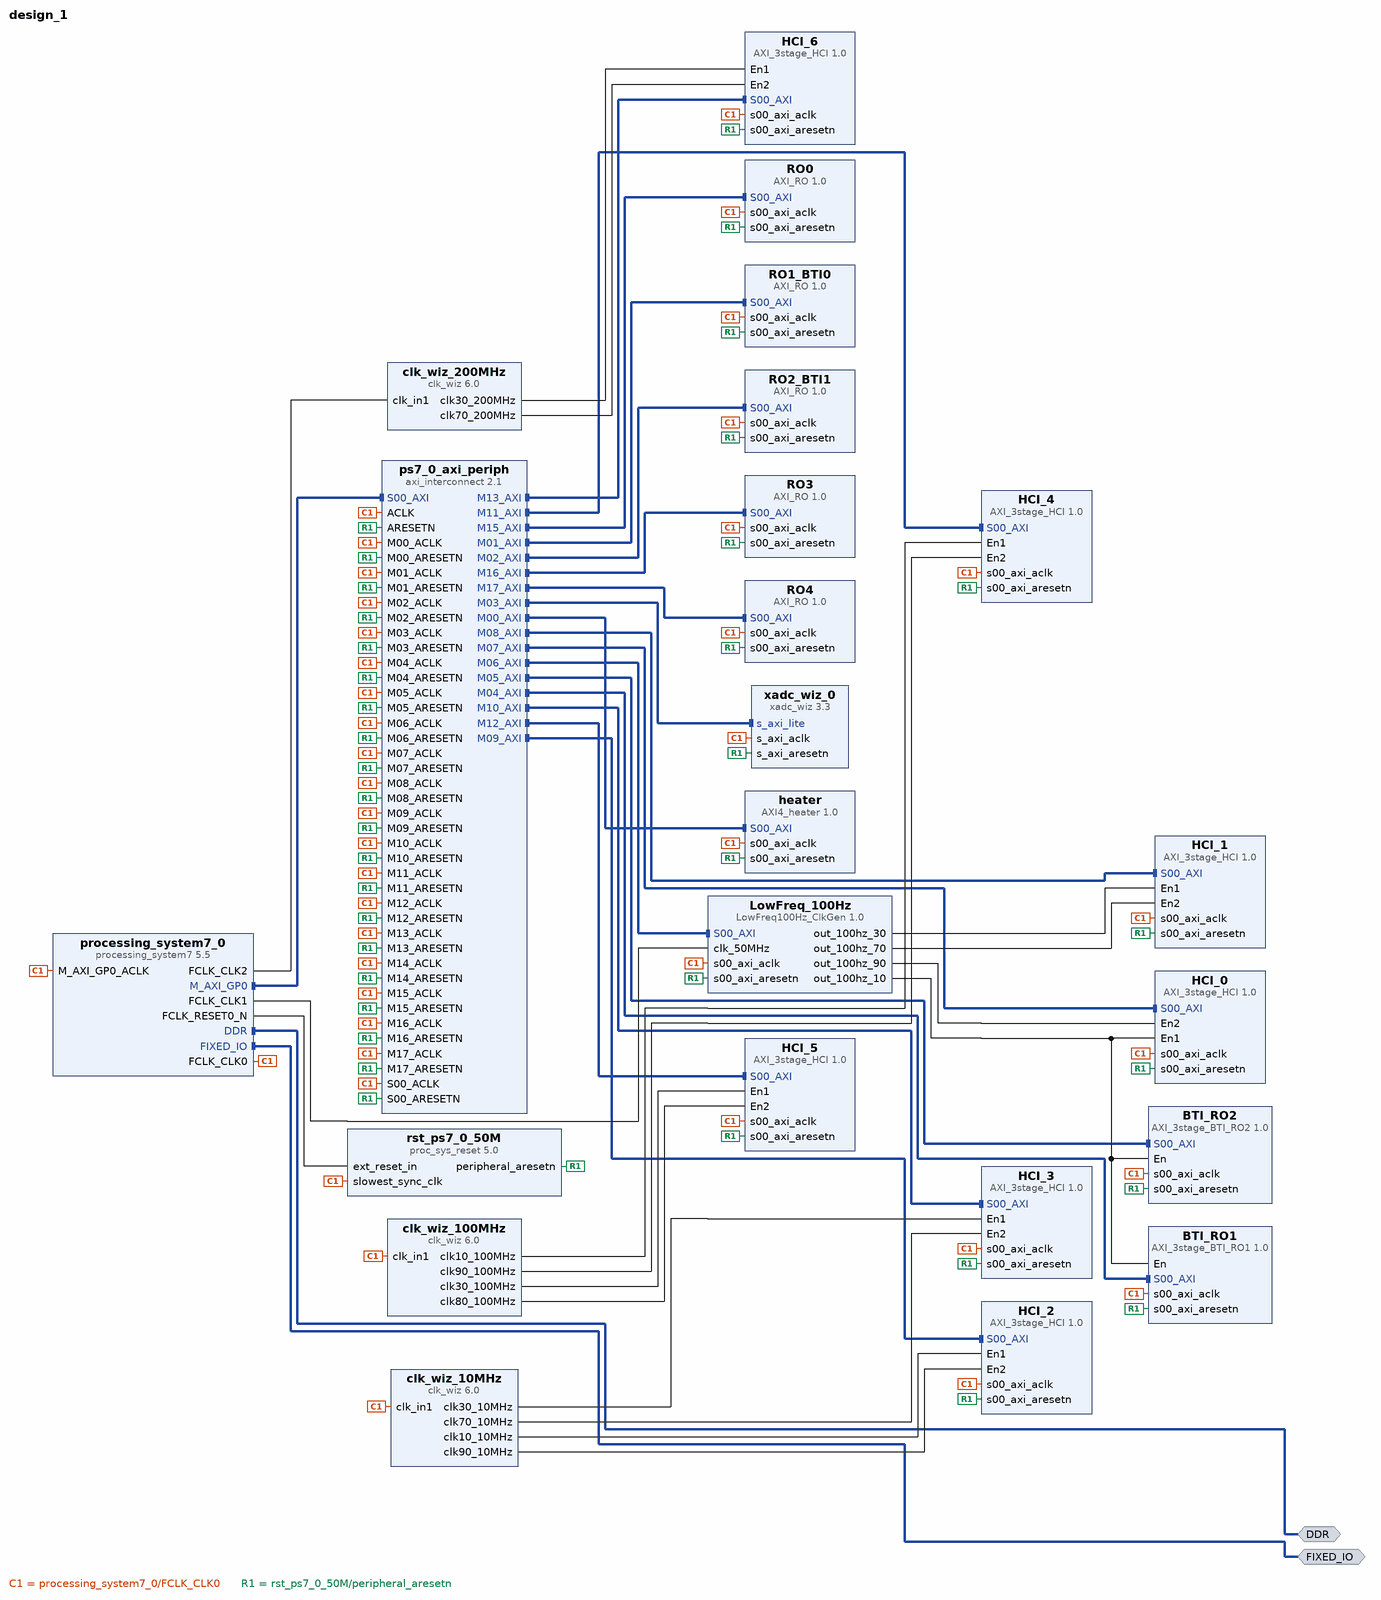
[diagram p0: block diagram of the top level]
# Vivado block design design_1, xc7z020clg400-1, Vivado 2020.1
create_bd_design design_1

create_bd_intf_port -mode Master -vlnv xilinx.com:interface:ddrx_rtl:1.0 DDR
create_bd_intf_port -mode Master -vlnv xilinx.com:display_processing_system7:fixedio_rtl:1.0 FIXED_IO

create_bd_cell -type ip -vlnv xilinx.com:user:AXI4_heater:1.0 heater
set_property -dict {CONFIG.block_size 36 CONFIG.num_blocks 64} [get_bd_cells heater]
create_bd_cell -type ip -vlnv xilinx.com:ip:xadc_wiz:3.3 xadc_wiz_0
set_property -dict [list \
  CONFIG.ENABLE_VCCDDRO_ALARM false \
  CONFIG.ENABLE_VCCPAUX_ALARM false \
  CONFIG.ENABLE_VCCPINT_ALARM false \
  CONFIG.OT_ALARM false \
  CONFIG.TEMPERATURE_ALARM_OT_RESET 125.0 \
  CONFIG.TEMPERATURE_ALARM_RESET 125.0 \
  CONFIG.TEMPERATURE_ALARM_TRIGGER 125.0 \
  CONFIG.USER_TEMP_ALARM false \
  CONFIG.VCCAUX_ALARM false \
  CONFIG.VCCINT_ALARM false \
] [get_bd_cells xadc_wiz_0]
create_bd_cell -type ip -vlnv xilinx.com:ip:processing_system7:5.5 processing_system7_0
set_property -dict [list \
  CONFIG.PCW_EN_CLK1_PORT 1 \
  CONFIG.PCW_EN_CLK2_PORT 1 \
  CONFIG.PCW_FCLK_CLK1_BUF TRUE \
  CONFIG.PCW_FPGA0_PERIPHERAL_FREQMHZ 100 \
  CONFIG.PCW_FPGA2_PERIPHERAL_FREQMHZ 250 \
  CONFIG.PCW_FPGA_FCLK1_ENABLE 1 \
  CONFIG.PCW_FPGA_FCLK2_ENABLE 1 \
] [get_bd_cells processing_system7_0]
# 32 more settings of processing_system7_0 are not shown: defaults, MIO pin electricals, DDR timing, and values the tool derives
create_bd_cell -type ip -vlnv xilinx.com:ip:axi_interconnect:2.1 ps7_0_axi_periph
set_property -dict {CONFIG.NUM_MI 18} [get_bd_cells ps7_0_axi_periph]
create_bd_cell -type ip -vlnv xilinx.com:ip:proc_sys_reset:5.0 rst_ps7_0_50M
create_bd_cell -type ip -vlnv xilinx.com:user:LowFreq100Hz_ClkGen:1.0 LowFreq_100Hz
create_bd_cell -type ip -vlnv xilinx.com:user:AXI_3stage_BTI_RO2:1.0 BTI_RO2
set_property -dict {CONFIG.num_oscillators 20} [get_bd_cells BTI_RO2]
create_bd_cell -type ip -vlnv xilinx.com:ip:clk_wiz:6.0 clk_wiz_100MHz
set_property -dict [list \
  CONFIG.CLKOUT1_REQUESTED_DUTY_CYCLE 10.000 \
  CONFIG.CLKOUT2_JITTER 130.958 \
  CONFIG.CLKOUT2_PHASE_ERROR 98.575 \
  CONFIG.CLKOUT2_REQUESTED_DUTY_CYCLE 90.000 \
  CONFIG.CLKOUT2_USED true \
  CONFIG.CLKOUT3_JITTER 130.958 \
  CONFIG.CLKOUT3_PHASE_ERROR 98.575 \
  CONFIG.CLKOUT3_REQUESTED_DUTY_CYCLE 30.000 \
  CONFIG.CLKOUT3_USED true \
  CONFIG.CLKOUT4_JITTER 130.958 \
  CONFIG.CLKOUT4_PHASE_ERROR 98.575 \
  CONFIG.CLKOUT4_REQUESTED_DUTY_CYCLE 70.000 \
  CONFIG.CLKOUT4_USED true \
  CONFIG.CLK_OUT1_PORT clk10_100MHz \
  CONFIG.CLK_OUT2_PORT clk90_100MHz \
  CONFIG.CLK_OUT3_PORT clk30_100MHz \
  CONFIG.CLK_OUT4_PORT clk80_100MHz \
  CONFIG.JITTER_SEL Min_O_Jitter \
  CONFIG.MMCM_BANDWIDTH HIGH \
  CONFIG.MMCM_CLKOUT0_DUTY_CYCLE 0.100 \
  CONFIG.MMCM_CLKOUT1_DIVIDE 10 \
  CONFIG.MMCM_CLKOUT1_DUTY_CYCLE 0.900 \
  CONFIG.MMCM_CLKOUT2_DIVIDE 10 \
  CONFIG.MMCM_CLKOUT2_DUTY_CYCLE 0.300 \
  CONFIG.MMCM_CLKOUT3_DIVIDE 10 \
  CONFIG.MMCM_CLKOUT3_DUTY_CYCLE 0.700 \
  CONFIG.NUM_OUT_CLKS 4 \
  CONFIG.USE_LOCKED false \
  CONFIG.USE_RESET false \
] [get_bd_cells clk_wiz_100MHz]
create_bd_cell -type ip -vlnv xilinx.com:ip:clk_wiz:6.0 clk_wiz_10MHz
set_property -dict [list \
  CONFIG.CLKIN1_JITTER_PS 100.0 \
  CONFIG.CLKOUT1_JITTER 231.613 \
  CONFIG.CLKOUT1_PHASE_ERROR 124.502 \
  CONFIG.CLKOUT1_REQUESTED_DUTY_CYCLE 10.000 \
  CONFIG.CLKOUT1_REQUESTED_OUT_FREQ 10.000 \
  CONFIG.CLKOUT2_JITTER 231.613 \
  CONFIG.CLKOUT2_PHASE_ERROR 124.502 \
  CONFIG.CLKOUT2_REQUESTED_DUTY_CYCLE 90.000 \
  CONFIG.CLKOUT2_REQUESTED_OUT_FREQ 10.000 \
  CONFIG.CLKOUT2_USED true \
  CONFIG.CLKOUT3_JITTER 231.613 \
  CONFIG.CLKOUT3_PHASE_ERROR 124.502 \
  CONFIG.CLKOUT3_REQUESTED_DUTY_CYCLE 30.000 \
  CONFIG.CLKOUT3_REQUESTED_OUT_FREQ 10.000 \
  CONFIG.CLKOUT3_USED true \
  CONFIG.CLKOUT4_JITTER 231.613 \
  CONFIG.CLKOUT4_PHASE_ERROR 124.502 \
  CONFIG.CLKOUT4_REQUESTED_DUTY_CYCLE 70.000 \
  CONFIG.CLKOUT4_REQUESTED_OUT_FREQ 10.000 \
  CONFIG.CLKOUT4_USED true \
  CONFIG.CLK_OUT1_PORT clk10_10MHz \
  CONFIG.CLK_OUT2_PORT clk90_10MHz \
  CONFIG.CLK_OUT3_PORT clk30_10MHz \
  CONFIG.CLK_OUT4_PORT clk70_10MHz \
  CONFIG.JITTER_SEL Min_O_Jitter \
  CONFIG.MMCM_BANDWIDTH HIGH \
  CONFIG.MMCM_CLKFBOUT_MULT_F 6.500 \
  CONFIG.MMCM_CLKIN1_PERIOD 10.000 \
  CONFIG.MMCM_CLKIN2_PERIOD 10.000 \
  CONFIG.MMCM_CLKOUT0_DIVIDE_F 65.000 \
  CONFIG.MMCM_CLKOUT0_DUTY_CYCLE 0.100 \
  CONFIG.MMCM_CLKOUT1_DIVIDE 65 \
  CONFIG.MMCM_CLKOUT1_DUTY_CYCLE 0.900 \
  CONFIG.MMCM_CLKOUT2_DIVIDE 65 \
  CONFIG.MMCM_CLKOUT2_DUTY_CYCLE 0.300 \
  CONFIG.MMCM_CLKOUT3_DIVIDE 65 \
  CONFIG.MMCM_CLKOUT3_DUTY_CYCLE 0.700 \
  CONFIG.MMCM_DIVCLK_DIVIDE 1 \
  CONFIG.NUM_OUT_CLKS 4 \
  CONFIG.USE_LOCKED false \
  CONFIG.USE_RESET false \
] [get_bd_cells clk_wiz_10MHz]
create_bd_cell -type ip -vlnv xilinx.com:ip:clk_wiz:6.0 clk_wiz_200MHz
set_property -dict [list \
  CONFIG.CLKIN1_JITTER_PS 40.0 \
  CONFIG.CLKOUT1_JITTER 93.521 \
  CONFIG.CLKOUT1_PHASE_ERROR 85.928 \
  CONFIG.CLKOUT1_REQUESTED_DUTY_CYCLE 30.000 \
  CONFIG.CLKOUT1_REQUESTED_OUT_FREQ 200.000 \
  CONFIG.CLKOUT2_JITTER 93.521 \
  CONFIG.CLKOUT2_PHASE_ERROR 85.928 \
  CONFIG.CLKOUT2_REQUESTED_DUTY_CYCLE 70.000 \
  CONFIG.CLKOUT2_REQUESTED_OUT_FREQ 200.000 \
  CONFIG.CLKOUT2_USED true \
  CONFIG.CLKOUT3_JITTER 137.681 \
  CONFIG.CLKOUT3_PHASE_ERROR 105.461 \
  CONFIG.CLKOUT3_REQUESTED_DUTY_CYCLE 30.000 \
  CONFIG.CLKOUT3_USED false \
  CONFIG.CLKOUT4_JITTER 137.681 \
  CONFIG.CLKOUT4_PHASE_ERROR 105.461 \
  CONFIG.CLKOUT4_REQUESTED_DUTY_CYCLE 80.000 \
  CONFIG.CLKOUT4_USED false \
  CONFIG.CLK_OUT1_PORT clk30_200MHz \
  CONFIG.CLK_OUT2_PORT clk70_200MHz \
  CONFIG.CLK_OUT3_PORT clk30_100MHz \
  CONFIG.CLK_OUT4_PORT clk80_100MHz \
  CONFIG.JITTER_SEL Min_O_Jitter \
  CONFIG.MMCM_BANDWIDTH HIGH \
  CONFIG.MMCM_CLKFBOUT_MULT_F 4.000 \
  CONFIG.MMCM_CLKIN1_PERIOD 4.000 \
  CONFIG.MMCM_CLKIN2_PERIOD 10.0 \
  CONFIG.MMCM_CLKOUT0_DIVIDE_F 5.000 \
  CONFIG.MMCM_CLKOUT0_DUTY_CYCLE 0.300 \
  CONFIG.MMCM_CLKOUT1_DIVIDE 5 \
  CONFIG.MMCM_CLKOUT1_DUTY_CYCLE 0.700 \
  CONFIG.MMCM_CLKOUT2_DIVIDE 1 \
  CONFIG.MMCM_CLKOUT2_DUTY_CYCLE 0.300 \
  CONFIG.MMCM_CLKOUT3_DIVIDE 1 \
  CONFIG.MMCM_CLKOUT3_DUTY_CYCLE 0.800 \
  CONFIG.MMCM_DIVCLK_DIVIDE 1 \
  CONFIG.NUM_OUT_CLKS 2 \
  CONFIG.PRIM_IN_FREQ 250.000 \
  CONFIG.PRIM_SOURCE Global_buffer \
  CONFIG.USE_LOCKED false \
  CONFIG.USE_RESET false \
] [get_bd_cells clk_wiz_200MHz]
create_bd_cell -type ip -vlnv xilinx.com:user:AXI_RO:1.0 RO0
set_property -dict {CONFIG.num_oscillators 5 CONFIG.num_stages 7} [get_bd_cells RO0]
create_bd_cell -type ip -vlnv xilinx.com:user:AXI_RO:1.0 RO3
set_property -dict {CONFIG.num_oscillators 5} [get_bd_cells RO3]
create_bd_cell -type ip -vlnv xilinx.com:user:AXI_RO:1.0 RO4
set_property -dict {CONFIG.num_oscillators 5 CONFIG.num_stages 3} [get_bd_cells RO4]
create_bd_cell -type ip -vlnv xilinx.com:user:AXI_3stage_BTI_RO1:1.0 BTI_RO1
set_property -dict {CONFIG.num_oscillators 20} [get_bd_cells BTI_RO1]
create_bd_cell -type ip -vlnv xilinx.com:user:AXI_3stage_HCI:1.0 HCI_0
set_property -dict {CONFIG.num_oscillators 20} [get_bd_cells HCI_0]
create_bd_cell -type ip -vlnv xilinx.com:user:AXI_3stage_HCI:1.0 HCI_1
set_property -dict {CONFIG.num_oscillators 20} [get_bd_cells HCI_1]
create_bd_cell -type ip -vlnv xilinx.com:user:AXI_3stage_HCI:1.0 HCI_2
set_property -dict {CONFIG.num_oscillators 20} [get_bd_cells HCI_2]
create_bd_cell -type ip -vlnv xilinx.com:user:AXI_3stage_HCI:1.0 HCI_3
set_property -dict {CONFIG.num_oscillators 20} [get_bd_cells HCI_3]
create_bd_cell -type ip -vlnv xilinx.com:user:AXI_3stage_HCI:1.0 HCI_4
set_property -dict {CONFIG.num_oscillators 20} [get_bd_cells HCI_4]
create_bd_cell -type ip -vlnv xilinx.com:user:AXI_3stage_HCI:1.0 HCI_5
set_property -dict {CONFIG.num_oscillators 20} [get_bd_cells HCI_5]
create_bd_cell -type ip -vlnv xilinx.com:user:AXI_3stage_HCI:1.0 HCI_6
set_property -dict {CONFIG.num_oscillators 20} [get_bd_cells HCI_6]
create_bd_cell -type ip -vlnv xilinx.com:user:AXI_RO:1.0 RO1_BTI0
set_property -dict {CONFIG.num_oscillators 5 CONFIG.num_stages 7} [get_bd_cells RO1_BTI0]
create_bd_cell -type ip -vlnv xilinx.com:user:AXI_RO:1.0 RO2_BTI1
set_property -dict {CONFIG.num_oscillators 5 CONFIG.num_stages 7} [get_bd_cells RO2_BTI1]

# ---- connections ----

connect_bd_intf_net [get_bd_intf_pins ps7_0_axi_periph/M01_AXI] [get_bd_intf_pins RO1_BTI0/S00_AXI]
connect_bd_intf_net [get_bd_intf_pins ps7_0_axi_periph/M09_AXI] [get_bd_intf_pins HCI_2/S00_AXI]
connect_bd_intf_net [get_bd_intf_pins ps7_0_axi_periph/M15_AXI] [get_bd_intf_pins RO0/S00_AXI]
connect_bd_intf_net [get_bd_intf_pins ps7_0_axi_periph/M05_AXI] [get_bd_intf_pins BTI_RO2/S00_AXI]
connect_bd_intf_net [get_bd_intf_pins ps7_0_axi_periph/M11_AXI] [get_bd_intf_pins HCI_4/S00_AXI]
connect_bd_intf_net [get_bd_intf_pins ps7_0_axi_periph/M03_AXI] [get_bd_intf_pins xadc_wiz_0/s_axi_lite]
connect_bd_intf_net [get_bd_intf_pins ps7_0_axi_periph/M00_AXI] [get_bd_intf_pins heater/S00_AXI]
connect_bd_intf_net [get_bd_intf_pins ps7_0_axi_periph/M16_AXI] [get_bd_intf_pins RO3/S00_AXI]
connect_bd_intf_net [get_bd_intf_pins ps7_0_axi_periph/M08_AXI] [get_bd_intf_pins HCI_1/S00_AXI]
connect_bd_intf_net [get_bd_intf_pins processing_system7_0/M_AXI_GP0] [get_bd_intf_pins ps7_0_axi_periph/S00_AXI]
connect_bd_intf_net [get_bd_intf_ports DDR] [get_bd_intf_pins processing_system7_0/DDR]
connect_bd_intf_net [get_bd_intf_ports FIXED_IO] [get_bd_intf_pins processing_system7_0/FIXED_IO]
connect_bd_intf_net [get_bd_intf_pins ps7_0_axi_periph/M17_AXI] [get_bd_intf_pins RO4/S00_AXI]
connect_bd_intf_net [get_bd_intf_pins ps7_0_axi_periph/M06_AXI] [get_bd_intf_pins LowFreq_100Hz/S00_AXI]
connect_bd_intf_net [get_bd_intf_pins ps7_0_axi_periph/M02_AXI] [get_bd_intf_pins RO2_BTI1/S00_AXI]
connect_bd_intf_net [get_bd_intf_pins ps7_0_axi_periph/M07_AXI] [get_bd_intf_pins HCI_0/S00_AXI]
connect_bd_intf_net [get_bd_intf_pins ps7_0_axi_periph/M13_AXI] [get_bd_intf_pins HCI_6/S00_AXI]
connect_bd_intf_net [get_bd_intf_pins ps7_0_axi_periph/M12_AXI] [get_bd_intf_pins HCI_5/S00_AXI]
connect_bd_intf_net [get_bd_intf_pins ps7_0_axi_periph/M04_AXI] [get_bd_intf_pins BTI_RO1/S00_AXI]
connect_bd_intf_net [get_bd_intf_pins ps7_0_axi_periph/M10_AXI] [get_bd_intf_pins HCI_3/S00_AXI]
connect_bd_net [get_bd_pins processing_system7_0/FCLK_CLK0] \
  [get_bd_pins processing_system7_0/M_AXI_GP0_ACLK] [get_bd_pins ps7_0_axi_periph/S00_ACLK] \
  [get_bd_pins rst_ps7_0_50M/slowest_sync_clk] [get_bd_pins heater/s00_axi_aclk] [get_bd_pins ps7_0_axi_periph/M00_ACLK] \
  [get_bd_pins ps7_0_axi_periph/ACLK] [get_bd_pins ps7_0_axi_periph/M01_ACLK] [get_bd_pins ps7_0_axi_periph/M02_ACLK] \
  [get_bd_pins xadc_wiz_0/s_axi_aclk] [get_bd_pins ps7_0_axi_periph/M03_ACLK] [get_bd_pins ps7_0_axi_periph/M04_ACLK] \
  [get_bd_pins ps7_0_axi_periph/M05_ACLK] [get_bd_pins LowFreq_100Hz/s00_axi_aclk] [get_bd_pins ps7_0_axi_periph/M06_ACLK] \
  [get_bd_pins BTI_RO2/s00_axi_aclk] [get_bd_pins ps7_0_axi_periph/M07_ACLK] [get_bd_pins ps7_0_axi_periph/M08_ACLK] \
  [get_bd_pins ps7_0_axi_periph/M09_ACLK] [get_bd_pins ps7_0_axi_periph/M10_ACLK] [get_bd_pins ps7_0_axi_periph/M11_ACLK] \
  [get_bd_pins ps7_0_axi_periph/M12_ACLK] [get_bd_pins ps7_0_axi_periph/M13_ACLK] [get_bd_pins clk_wiz_100MHz/clk_in1] \
  [get_bd_pins clk_wiz_10MHz/clk_in1] [get_bd_pins ps7_0_axi_periph/M14_ACLK] [get_bd_pins RO0/s00_axi_aclk] \
  [get_bd_pins ps7_0_axi_periph/M15_ACLK] [get_bd_pins RO3/s00_axi_aclk] [get_bd_pins ps7_0_axi_periph/M16_ACLK] \
  [get_bd_pins RO4/s00_axi_aclk] [get_bd_pins ps7_0_axi_periph/M17_ACLK] [get_bd_pins BTI_RO1/s00_axi_aclk] \
  [get_bd_pins HCI_0/s00_axi_aclk] [get_bd_pins HCI_1/s00_axi_aclk] [get_bd_pins HCI_2/s00_axi_aclk] \
  [get_bd_pins HCI_3/s00_axi_aclk] [get_bd_pins HCI_4/s00_axi_aclk] [get_bd_pins HCI_5/s00_axi_aclk] \
  [get_bd_pins HCI_6/s00_axi_aclk] [get_bd_pins RO1_BTI0/s00_axi_aclk] [get_bd_pins RO2_BTI1/s00_axi_aclk]
connect_bd_net [get_bd_pins processing_system7_0/FCLK_RESET0_N] [get_bd_pins rst_ps7_0_50M/ext_reset_in]
connect_bd_net [get_bd_pins rst_ps7_0_50M/peripheral_aresetn] \
  [get_bd_pins ps7_0_axi_periph/S00_ARESETN] [get_bd_pins heater/s00_axi_aresetn] [get_bd_pins ps7_0_axi_periph/M00_ARESETN] \
  [get_bd_pins ps7_0_axi_periph/ARESETN] [get_bd_pins ps7_0_axi_periph/M01_ARESETN] \
  [get_bd_pins ps7_0_axi_periph/M02_ARESETN] [get_bd_pins xadc_wiz_0/s_axi_aresetn] \
  [get_bd_pins ps7_0_axi_periph/M03_ARESETN] [get_bd_pins ps7_0_axi_periph/M04_ARESETN] \
  [get_bd_pins ps7_0_axi_periph/M05_ARESETN] [get_bd_pins LowFreq_100Hz/s00_axi_aresetn] \
  [get_bd_pins ps7_0_axi_periph/M06_ARESETN] [get_bd_pins BTI_RO2/s00_axi_aresetn] [get_bd_pins ps7_0_axi_periph/M07_ARESETN] \
  [get_bd_pins ps7_0_axi_periph/M08_ARESETN] [get_bd_pins ps7_0_axi_periph/M09_ARESETN] \
  [get_bd_pins ps7_0_axi_periph/M10_ARESETN] [get_bd_pins ps7_0_axi_periph/M11_ARESETN] \
  [get_bd_pins ps7_0_axi_periph/M12_ARESETN] [get_bd_pins ps7_0_axi_periph/M13_ARESETN] \
  [get_bd_pins ps7_0_axi_periph/M14_ARESETN] [get_bd_pins RO0/s00_axi_aresetn] [get_bd_pins ps7_0_axi_periph/M15_ARESETN] \
  [get_bd_pins RO3/s00_axi_aresetn] [get_bd_pins ps7_0_axi_periph/M16_ARESETN] [get_bd_pins RO4/s00_axi_aresetn] \
  [get_bd_pins ps7_0_axi_periph/M17_ARESETN] [get_bd_pins BTI_RO1/s00_axi_aresetn] [get_bd_pins HCI_0/s00_axi_aresetn] \
  [get_bd_pins HCI_1/s00_axi_aresetn] [get_bd_pins HCI_2/s00_axi_aresetn] [get_bd_pins HCI_3/s00_axi_aresetn] \
  [get_bd_pins HCI_4/s00_axi_aresetn] [get_bd_pins HCI_5/s00_axi_aresetn] [get_bd_pins HCI_6/s00_axi_aresetn] \
  [get_bd_pins RO1_BTI0/s00_axi_aresetn] [get_bd_pins RO2_BTI1/s00_axi_aresetn]
connect_bd_net [get_bd_pins processing_system7_0/FCLK_CLK1] [get_bd_pins LowFreq_100Hz/clk_50MHz]
connect_bd_net -net LowFreq100Hz_ClkGen_0_out_100hz_10 [get_bd_pins LowFreq_100Hz/out_100hz_10] \
  [get_bd_pins BTI_RO2/En] [get_bd_pins BTI_RO1/En] [get_bd_pins HCI_0/En1]
connect_bd_net -net LowFreq100Hz_ClkGen_0_out_100hz_90 [get_bd_pins LowFreq_100Hz/out_100hz_90] [get_bd_pins HCI_0/En2]
connect_bd_net -net LowFreq100Hz_ClkGen_0_out_100hz_30 [get_bd_pins LowFreq_100Hz/out_100hz_30] [get_bd_pins HCI_1/En1]
connect_bd_net -net LowFreq100Hz_ClkGen_0_out_100hz_70 [get_bd_pins LowFreq_100Hz/out_100hz_70] [get_bd_pins HCI_1/En2]
connect_bd_net -net clk_wiz_1_clk10_10MHz [get_bd_pins clk_wiz_10MHz/clk10_10MHz] [get_bd_pins HCI_2/En1]
connect_bd_net -net clk_wiz_1_clk90_10MHz [get_bd_pins clk_wiz_10MHz/clk90_10MHz] [get_bd_pins HCI_2/En2]
connect_bd_net -net clk_wiz_1_clk30_10MHz [get_bd_pins clk_wiz_10MHz/clk30_10MHz] [get_bd_pins HCI_3/En1]
connect_bd_net -net clk_wiz_1_clk70_10MHz [get_bd_pins clk_wiz_10MHz/clk70_10MHz] [get_bd_pins HCI_3/En2]
connect_bd_net -net clk_wiz_0_clk10_100MHz [get_bd_pins clk_wiz_100MHz/clk10_100MHz] [get_bd_pins HCI_4/En1]
connect_bd_net -net clk_wiz_0_clk90_100MHz [get_bd_pins clk_wiz_100MHz/clk90_100MHz] [get_bd_pins HCI_4/En2]
connect_bd_net -net clk_wiz_0_clk30_100MHz [get_bd_pins clk_wiz_100MHz/clk30_100MHz] [get_bd_pins HCI_5/En1]
connect_bd_net -net clk_wiz_0_clk80_100MHz [get_bd_pins clk_wiz_100MHz/clk80_100MHz] [get_bd_pins HCI_5/En2]
connect_bd_net [get_bd_pins processing_system7_0/FCLK_CLK2] [get_bd_pins clk_wiz_200MHz/clk_in1]
connect_bd_net -net clk_wiz_250MHz_clk30_200MHz [get_bd_pins clk_wiz_200MHz/clk30_200MHz] [get_bd_pins HCI_6/En1]
connect_bd_net -net clk_wiz_250MHz_clk70_200MHz [get_bd_pins clk_wiz_200MHz/clk70_200MHz] [get_bd_pins HCI_6/En2]

# ---- address map ----
assign_bd_address -offset 0x43C00000 -range 64K -target_address_space [get_bd_addr_spaces processing_system7_0/Data] [get_bd_addr_segs heater/S00_AXI/S00_AXI_reg]
assign_bd_address -offset 0x43C10000 -range 64K -target_address_space [get_bd_addr_spaces processing_system7_0/Data] [get_bd_addr_segs RO1_BTI0/S00_AXI/S00_AXI_reg]
assign_bd_address -offset 0x43C20000 -range 64K -target_address_space [get_bd_addr_spaces processing_system7_0/Data] [get_bd_addr_segs RO2_BTI1/S00_AXI/S00_AXI_reg]
assign_bd_address -offset 0x43C30000 -range 64K -target_address_space [get_bd_addr_spaces processing_system7_0/Data] [get_bd_addr_segs xadc_wiz_0/s_axi_lite/Reg]
assign_bd_address -offset 0x43C40000 -range 64K -target_address_space [get_bd_addr_spaces processing_system7_0/Data] [get_bd_addr_segs BTI_RO1/S00_AXI/S00_AXI_reg]
assign_bd_address -offset 0x43C50000 -range 64K -target_address_space [get_bd_addr_spaces processing_system7_0/Data] [get_bd_addr_segs BTI_RO2/S00_AXI/S00_AXI_reg]
assign_bd_address -offset 0x43C60000 -range 64K -target_address_space [get_bd_addr_spaces processing_system7_0/Data] [get_bd_addr_segs LowFreq_100Hz/S00_AXI/S00_AXI_reg]
assign_bd_address -offset 0x43C70000 -range 64K -target_address_space [get_bd_addr_spaces processing_system7_0/Data] [get_bd_addr_segs HCI_0/S00_AXI/S00_AXI_reg]
assign_bd_address -offset 0x43C80000 -range 64K -target_address_space [get_bd_addr_spaces processing_system7_0/Data] [get_bd_addr_segs HCI_1/S00_AXI/S00_AXI_reg]
assign_bd_address -offset 0x43C90000 -range 64K -target_address_space [get_bd_addr_spaces processing_system7_0/Data] [get_bd_addr_segs HCI_2/S00_AXI/S00_AXI_reg]
assign_bd_address -offset 0x43CA0000 -range 64K -target_address_space [get_bd_addr_spaces processing_system7_0/Data] [get_bd_addr_segs HCI_3/S00_AXI/S00_AXI_reg]
assign_bd_address -offset 0x43CB0000 -range 64K -target_address_space [get_bd_addr_spaces processing_system7_0/Data] [get_bd_addr_segs HCI_4/S00_AXI/S00_AXI_reg]
assign_bd_address -offset 0x43CC0000 -range 64K -target_address_space [get_bd_addr_spaces processing_system7_0/Data] [get_bd_addr_segs HCI_5/S00_AXI/S00_AXI_reg]
assign_bd_address -offset 0x43CD0000 -range 64K -target_address_space [get_bd_addr_spaces processing_system7_0/Data] [get_bd_addr_segs HCI_6/S00_AXI/S00_AXI_reg]
assign_bd_address -offset 0x43CF0000 -range 64K -target_address_space [get_bd_addr_spaces processing_system7_0/Data] [get_bd_addr_segs RO0/S00_AXI/S00_AXI_reg]
assign_bd_address -offset 0x43D00000 -range 64K -target_address_space [get_bd_addr_spaces processing_system7_0/Data] [get_bd_addr_segs RO3/S00_AXI/S00_AXI_reg]
assign_bd_address -offset 0x43D10000 -range 64K -target_address_space [get_bd_addr_spaces processing_system7_0/Data] [get_bd_addr_segs RO4/S00_AXI/S00_AXI_reg]

validate_bd_design
save_bd_design
